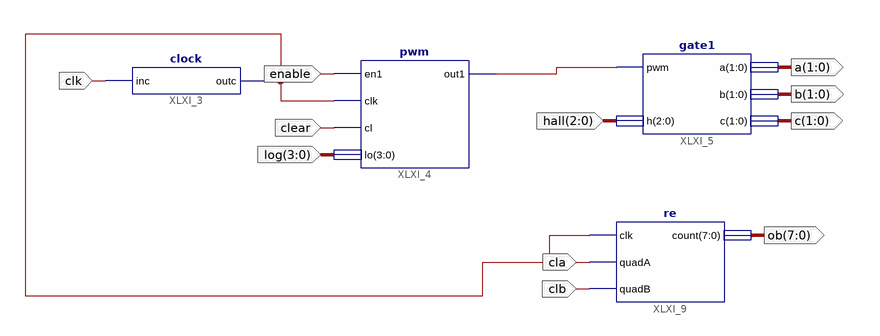
[diagram p0: schematic sheet 1]
// Xilinx ISE schematic test_motor_encoder.sch (spartan6) as structural Verilog: 4 symbols, 11 ports
module test_motor_encoder (
  input  clk,
  input  enable,
  input  clear,
  input  [3:0] log,
  input  [2:0] hall,
  input  cla,
  input  clb,
  output [1:0] a,
  output [1:0] b,
  output [1:0] c,
  output [7:0] ob
);

  wire XLXN_3, XLXN_11;

  clock XLXI_3 (.inc(clk), .outc(XLXN_11));
  pwm XLXI_4 (.en1(enable), .clk(XLXN_11), .cl(clear), .lo(log), .out1(XLXN_3));
  gate1 XLXI_5 (.pwm(XLXN_3), .h(hall), .a(a), .b(b), .c(c));
  re XLXI_9 (.clk(XLXN_11), .quadA(cla), .quadB(clb), .count(ob));
endmodule
